# Altium schematic sheet HalfBridge.SchDoc
size A1; SheetNumber: 2; SheetTotal: 5
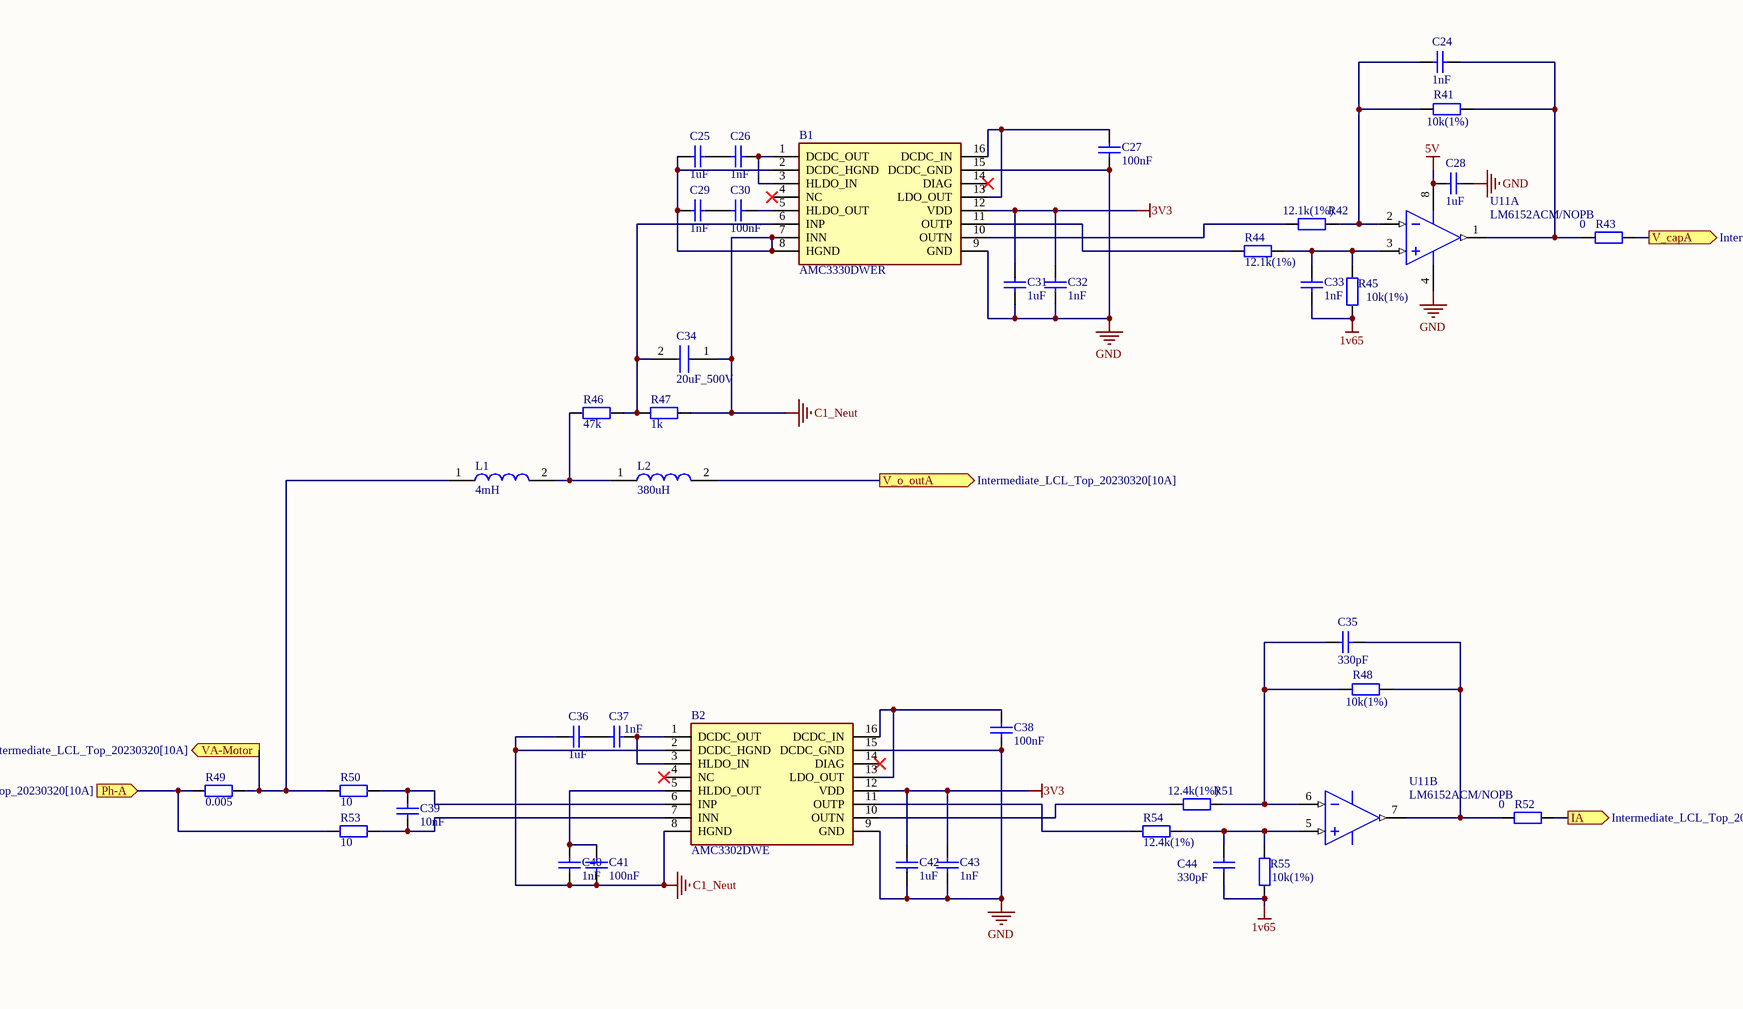
[diagram p0: HalfBridge.SchDoc, top left]
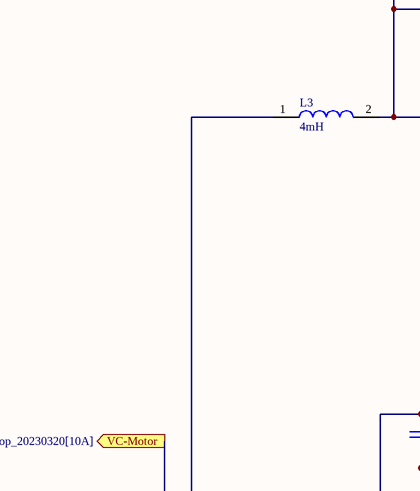
[diagram p1: HalfBridge.SchDoc, top middle]
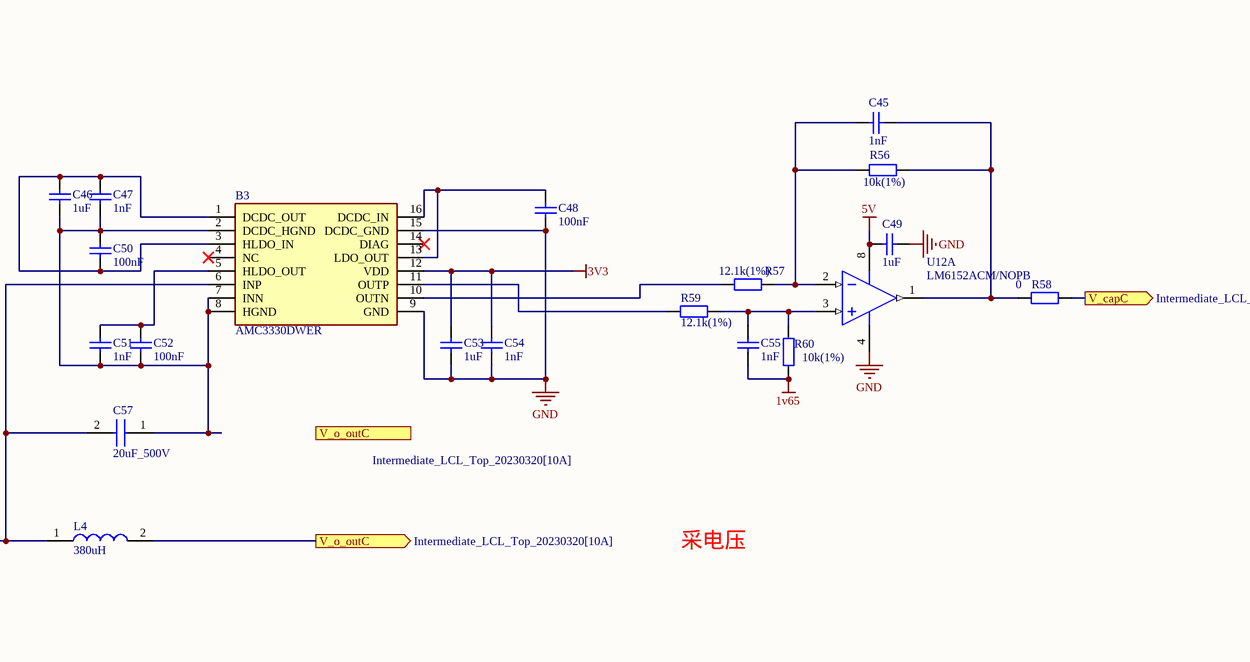
[diagram p2: HalfBridge.SchDoc, top right]
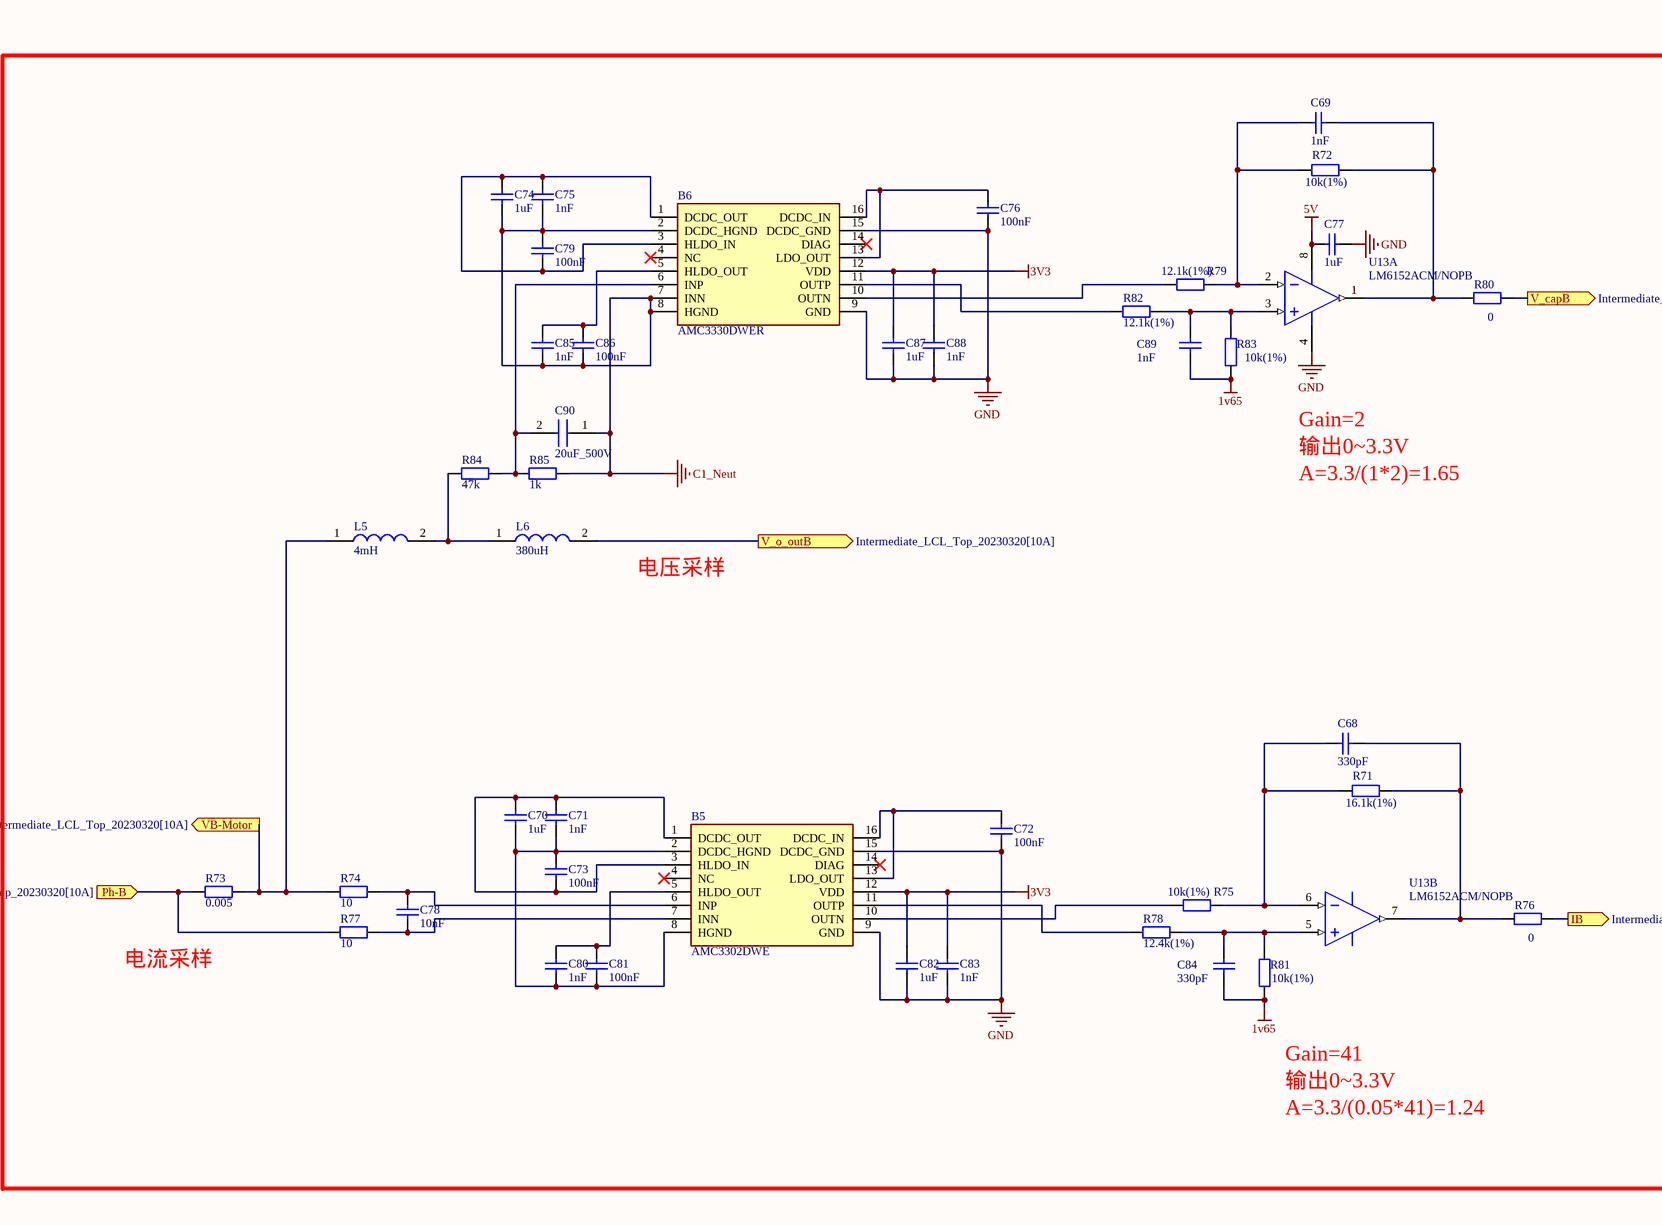
[diagram p3: HalfBridge.SchDoc, bottom left]
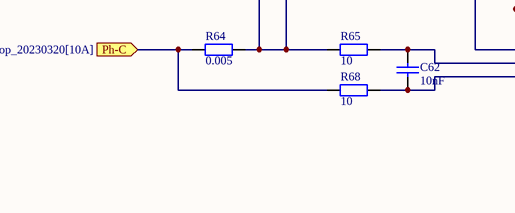
[diagram p4: HalfBridge.SchDoc, bottom middle]
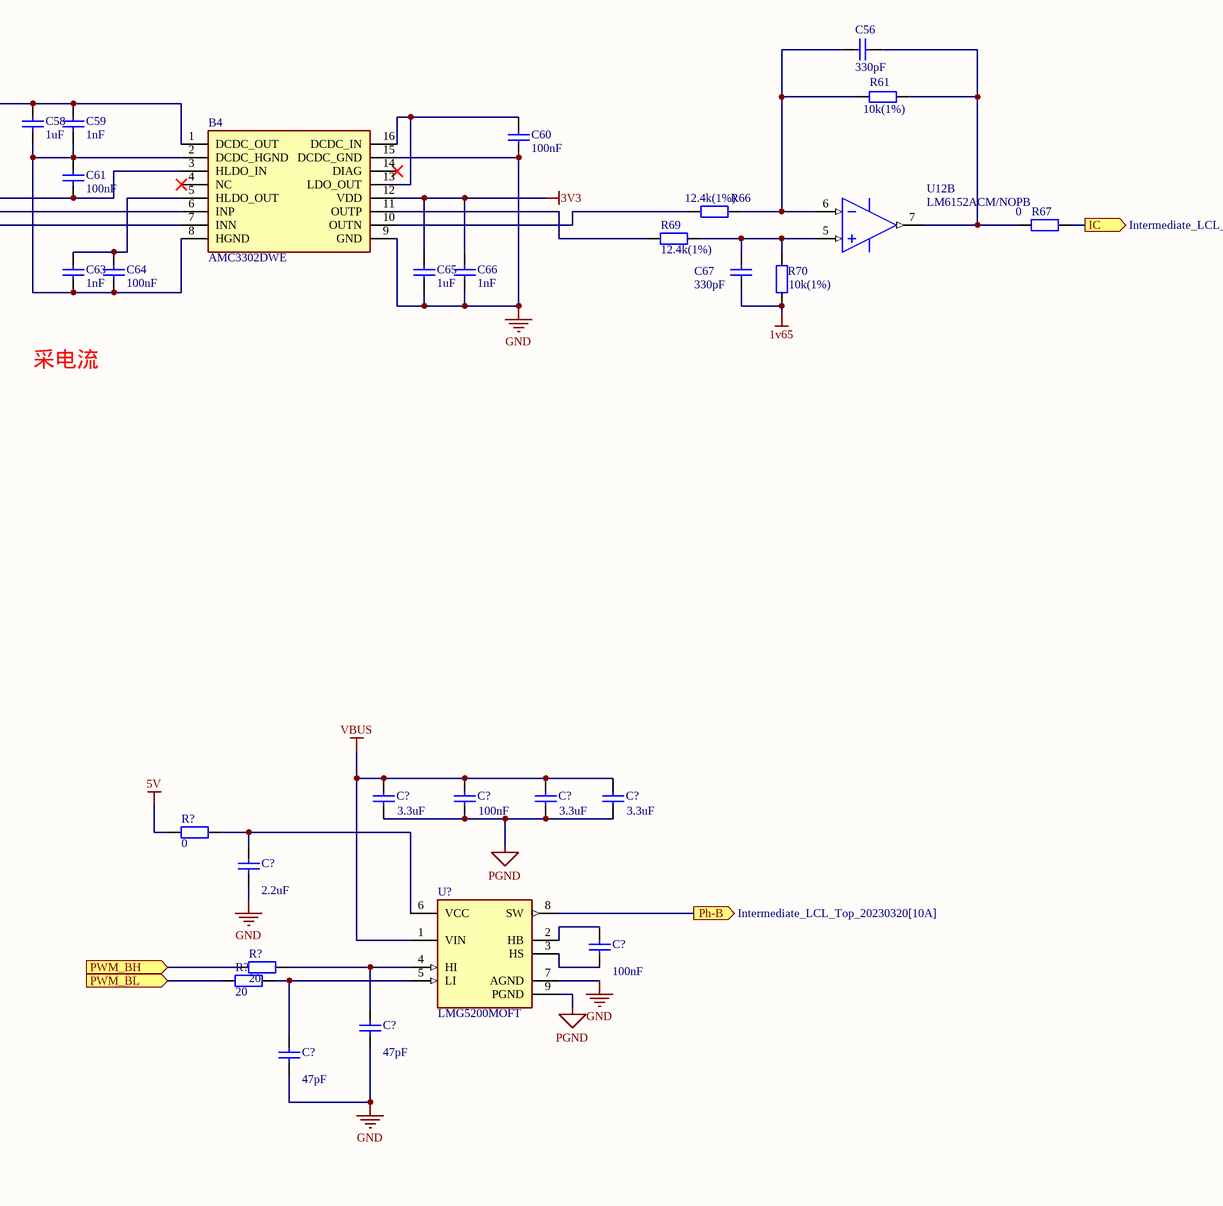
[diagram p5: HalfBridge.SchDoc, bottom right]

## Parts
(Parts that share a designator on the sheet are numbered #1, #2 ... from top to bottom, then left to right.)
B1  AMC3330DWER  [SOIC127P1030X265-16N]
B2  AMC3302DWE  [SOIC127P1030X265-16N]
B3  AMC3330DWER  [SOIC127P1030X265-16N]
B4  AMC3302DWE  [SOIC127P1030X265-16N]
B5  AMC3302DWE  [SOIC127P1030X265-16N]
B6  AMC3330DWER  [SOIC127P1030X265-16N]
C24  1nF  [CAPC1608X06N]
C25  1uF  [CAPC1608X06N]
C26  1nF  [CAPC1608X06N]
C27  100nF  [CAPC1608X06N]
C28  1uF  [CAPC1608X06N]
C29  1nF  [CAPC1608X06N]
C30  100nF  [CAPC1608X06N]
C31  1uF  [CAPC1608X06N]
C32  1nF  [CAPC1608X06N]
C33  1nF  [CAPC1608X06N]
C34  20uF_500V  [Film Capacitor PHE450HF7220JR06L2]
C35  330pF  [CAPC1608X06N]
C36  1uF  [CAPC1608X06N]
C37  1nF  [CAPC1608X06N]
C38  100nF  [CAPC1608X06N]
C39  10nF  [CAPC1608X06N]
C40  1nF  [CAPC1608X06N]
C41  100nF  [CAPC1608X06N]
C42  1uF  [CAPC1608X06N]
C43  1nF  [CAPC1608X06N]
C44  330pF  [CAPC1608X06N]
C45  1nF  [CAPC1608X06N]
C46  1uF  [CAPC1608X06N]
C47  1nF  [CAPC1608X06N]
C48  100nF  [CAPC1608X06N]
C49  1uF  [CAPC1608X06N]
C50  100nF  [CAPC1608X06N]
C51  1nF  [CAPC1608X06N]
C52  100nF  [CAPC1608X06N]
C53  1uF  [CAPC1608X06N]
C54  1nF  [CAPC1608X06N]
C55  1nF  [CAPC1608X06N]
C56  330pF  [CAPC1608X06N]
C57  20uF_500V  [Film Capacitor PHE450HF7220JR06L2]
C58  1uF  [CAPC1608X06N]
C59  1nF  [CAPC1608X06N]
C60  100nF  [CAPC1608X06N]
C61  100nF  [CAPC1608X06N]
C62  10nF  [CAPC1608X06N]
C63  1nF  [CAPC1608X06N]
C64  100nF  [CAPC1608X06N]
C65  1uF  [CAPC1608X06N]
C66  1nF  [CAPC1608X06N]
C67  330pF  [CAPC1608X06N]
C68  330pF  [CAPC1608X06N]
C69  1nF  [CAPC1608X06N]
C70  1uF  [CAPC1608X06N]
C71  1nF  [CAPC1608X06N]
C72  100nF  [CAPC1608X06N]
C73  100nF  [CAPC1608X06N]
C74  1uF  [CAPC1608X06N]
C75  1nF  [CAPC1608X06N]
C76  100nF  [CAPC1608X06N]
C77  1uF  [CAPC1608X06N]
C78  10nF  [CAPC1608X06N]
C79  100nF  [CAPC1608X06N]
C80  1nF  [CAPC1608X06N]
C81  100nF  [CAPC1608X06N]
C82  1uF  [CAPC1608X06N]
C83  1nF  [CAPC1608X06N]
C84  330pF  [CAPC1608X06N]
C85  1nF  [CAPC1608X06N]
C86  100nF  [CAPC1608X06N]
C87  1uF  [CAPC1608X06N]
C88  1nF  [CAPC1608X06N]
C89  1nF  [CAPC1608X06N]
C90  20uF_500V  [Film Capacitor PHE450HF7220JR06L2]
C?#1  100nF  [CAPC1608X06N]
C?#2  3.3uF  [CAPC1608X06N]
C?#3  3.3uF  [CAPC1608X06N]
C?#4  3.3uF  [CAPC1608X06N]
C?#5  2.2uF  [CAPC1608X06N]
C?#6  100nF  [CAPC1608X06N]
C?#7  47pF  [CAPC1608X06N]
C?#8  47pF  [CAPC1608X06N]
L1  4mH  [4mH Custom]
L2  380uH  [380uH Custom]
L3  4mH  [4mH Custom]
L4  380uH  [380uH Custom]
L5  4mH  [4mH Custom]
L6  380uH  [380uH Custom]
R41  10k(1%)  [RESC1608X05N]
R42  12.1k(1%)  [RESC1608X05N]
R43  0  [RESC1608X05N]
R44  12.1k(1%)  [RESC1608X05N]
R45  10k(1%)  [RESC1608X05N]
R46  47k  [RESC1608X05N]
R47  1k  [RESC1608X05N]
R48  10k(1%)  [RESC1608X05N]
R49  0.005  [RESC1608X05N]
R50  10  [RESC1608X05N]
R51  12.4k(1%)  [RESC1608X05N]
R52  0  [RESC1608X05N]
R53  10  [RESC1608X05N]
R54  12.4k(1%)  [RESC1608X05N]
R55  10k(1%)  [RESC1608X05N]
R56  10k(1%)  [RESC1608X05N]
R57  12.1k(1%)  [RESC1608X05N]
R58  0  [RESC1608X05N]
R59  12.1k(1%)  [RESC1608X05N]
R60  10k(1%)  [RESC1608X05N]
R61  10k(1%)  [RESC1608X05N]
R64  0.005  [RESC1608X05N]
R65  10  [RESC1608X05N]
R66  12.4k(1%)  [RESC1608X05N]
R67  0  [RESC1608X05N]
R68  10  [RESC1608X05N]
R69  12.4k(1%)  [RESC1608X05N]
R70  10k(1%)  [RESC1608X05N]
R71  16.1k(1%)  [RESC1608X05N]
R72  10k(1%)  [RESC1608X05N]
R73  0.005  [RESC1608X05N]
R74  10  [RESC1608X05N]
R75  10k(1%)  [RESC1608X05N]
R76  0  [RESC1608X05N]
R77  10  [RESC1608X05N]
R78  12.4k(1%)  [RESC1608X05N]
R79  12.1k(1%)  [RESC1608X05N]
R80  0  [RESC1608X05N]
R81  10k(1%)  [RESC1608X05N]
R82  12.1k(1%)  [RESC1608X05N]
R83  10k(1%)  [RESC1608X05N]
R84  47k  [RESC1608X05N]
R85  1k  [RESC1608X05N]
R?#1  0  [RESC1608X05N]
R?#2  20  [RESC1608X05N]
R?#3  20  [RESC1608X05N]
U11  LM6152ACM/NOPB  [D0008A_L]  (parts A,B of 2)
U12  LM6152ACM/NOPB  [D0008A_L]  (parts A,B of 2)
U13  LM6152ACM/NOPB  [D0008A_L]  (parts A,B of 2)
U?  LMG5200MOFT  [FP-MOF0009A-MFG]

## Ports
IA (out, see Intermediate_LCL_Top_20230320[10A], Phase Current Voltage Sense[1B]), IB (out, see Intermediate_LCL_Top_20230320[10A], Phase Current Voltage Sense[1C]), IC (out, see Intermediate_LCL_Top_20230320[10A], Phase Current Voltage Sense[1D]), Ph-A (in, see Intermediate_LCL_Top_20230320[10A]), Ph-B (in, see Intermediate_LCL_Top_20230320[10A]), Ph-B (out, see Intermediate_LCL_Top_20230320[10A]), Ph-C (in, see Intermediate_LCL_Top_20230320[10A]), PWM_BH (in), PWM_BL (in), V_capA (out, see Intermediate_LCL_Top_20230320[10A]), V_capB (out, see Intermediate_LCL_Top_20230320[10A]), V_capC (out, see Intermediate_LCL_Top_20230320[10A]), V_o_outA (out, see Intermediate_LCL_Top_20230320[10A]), V_o_outB (out, see Intermediate_LCL_Top_20230320[10A]), V_o_outC (out, see Intermediate_LCL_Top_20230320[10A]), VA-Motor (out, see Intermediate_LCL_Top_20230320[10A]), VB-Motor (out, see Intermediate_LCL_Top_20230320[10A]), VC-Motor (out, see Intermediate_LCL_Top_20230320[10A])

## Nets
1v65: C33.1 C44.1 C55.1 C67.1 C84.1 C89.1 R45.1 R55.1 R60.1 R70.1 R81.1 R83.1
3V3: B1.12(VDD) B2.12(VDD) B3.12(VDD) B4.12(VDD) B5.12(VDD) B6.12(VDD) C31.1 C32.1 C42.1 C43.1 C53.1 C54.1 C65.1 C66.1 C82.1 C83.1 C87.1 C88.1
5V: C28.2 C49.2 C77.2 R?#1.2 U11.8(V+) U12.8(V+) U13.8(V+)
C1_Neut: B1.2(DCDC_HGND) B1.7(INN) B1.8(HGND) B2.2(DCDC_HGND) B2.8(HGND) B6.2(DCDC_HGND) B6.7(INN) B6.8(HGND) C25.1 C29.1 C34.1 C36.1 C40.2 C41.2 C74.2 C75.2 C79.1 C85.2 C86.2 C90.1 R47.1 R85.1
GND: B1.9(GND) B1.15(DCDC_GND) B2.9(GND) B2.15(DCDC_GND) B3.9(GND) B3.15(DCDC_GND) B4.9(GND) B4.15(DCDC_GND) B5.9(GND) B5.15(DCDC_GND) B6.9(GND) B6.15(DCDC_GND) C27.2 C28.1 C31.2 C32.2 C38.2 C42.2 C43.2 C48.2 C49.1 C53.2 C54.2 C60.2 C65.2 C66.2 C72.2 C76.2 C77.1 C82.2 C83.2 C87.2 C88.2 C?#5.1 C?#7.2 C?#8.2 U11.4(V-) U12.4(V-) U13.4(V-) U?.7(AGND)
PGND: C?#1.2 C?#2.1 C?#3.1 C?#4.1 U?.9(PGND)
VBUS: C?#1.1 C?#2.2 C?#3.2 C?#4.2 U?.1(VIN)
IA: R52.1 ; port IA
IB: R76.1 ; port IB
IC: R67.1 ; port IC
Ph-A: R49.1 R53.1 ; port Ph-A
Ph-B: R73.1 R77.1 U?.8(SW) ; port Ph-B
Ph-C: R64.1 R68.1 ; port Ph-C
PWM_BH: R?#2.2 ; port PWM_BH
PWM_BL: R?#3.2 ; port PWM_BL
V_capA: R43.1 ; port V_capA
V_capB: R80.1 ; port V_capB
V_capC: R58.1 ; port V_capC
V_o_outA: L2.2 ; port V_o_outA
V_o_outB: L6.2 ; port V_o_outB
V_o_outC: L4.2 ; port V_o_outC
VA-Motor: L1.1 R49.2 R50.1 ; port VA-Motor
VB-Motor: L5.1 R73.2 R74.1 ; port VB-Motor
VC-Motor: L3.1 R64.2 R65.1 ; port VC-Motor
NetB1_1: B1.1(DCDC_OUT) B1.3(HLDO_IN) C26.2
NetB1_5: B1.5(HLDO_OUT) C30.2
NetB1_6: B1.6(INP) C34.2 R46.1 R47.2
NetB1_10: B1.10(OUTN) R42.2
NetB1_11: B1.11(OUTP) R44.1
NetB1_13: B1.13(LDO_OUT) B1.16(DCDC_IN) C27.1
NetB2_1: B2.1(DCDC_OUT) B2.3(HLDO_IN) C37.2
NetB2_5: B2.5(HLDO_OUT) C40.1 C41.1
NetB2_6: B2.6(INP) C39.1 R50.2
NetB2_7: B2.7(INN) C39.2 R53.2
NetB2_10: B2.10(OUTN) R51.2
NetB2_11: B2.11(OUTP) R54.1
NetB2_13: B2.13(LDO_OUT) B2.16(DCDC_IN) C38.1
NetB3_1: B3.1(DCDC_OUT) B3.3(HLDO_IN) C46.1 C47.1 C50.2
NetB3_2: B3.2(DCDC_HGND) B3.7(INN) B3.8(HGND) C46.2 C47.2 C50.1 C51.2 C52.2 C57.1
NetB3_5: B3.5(HLDO_OUT) C51.1 C52.1
NetB3_6: B3.6(INP) C57.2 L3.2 L4.1
NetB3_10: B3.10(OUTN) R57.2
NetB3_11: B3.11(OUTP) R59.1
NetB3_13: B3.13(LDO_OUT) B3.16(DCDC_IN) C48.1
NetB4_1: B4.1(DCDC_OUT) B4.3(HLDO_IN) C58.1 C59.1 C61.2
NetB4_2: B4.2(DCDC_HGND) B4.8(HGND) C58.2 C59.2 C61.1 C63.2 C64.2
NetB4_5: B4.5(HLDO_OUT) C63.1 C64.1
NetB4_6: B4.6(INP) C62.1 R65.2
NetB4_7: B4.7(INN) C62.2 R68.2
NetB4_10: B4.10(OUTN) R66.2
NetB4_11: B4.11(OUTP) R69.1
NetB4_13: B4.13(LDO_OUT) B4.16(DCDC_IN) C60.1
NetB5_1: B5.1(DCDC_OUT) B5.3(HLDO_IN) C70.1 C71.1 C73.2
NetB5_2: B5.2(DCDC_HGND) B5.8(HGND) C70.2 C71.2 C73.1 C80.2 C81.2
NetB5_5: B5.5(HLDO_OUT) C80.1 C81.1
NetB5_6: B5.6(INP) C78.1 R74.2
NetB5_7: B5.7(INN) C78.2 R77.2
NetB5_10: B5.10(OUTN) R75.2
NetB5_11: B5.11(OUTP) R78.1
NetB5_13: B5.13(LDO_OUT) B5.16(DCDC_IN) C72.1
NetB6_1: B6.1(DCDC_OUT) B6.3(HLDO_IN) C74.1 C75.1 C79.2
NetB6_5: B6.5(HLDO_OUT) C85.1 C86.1
NetB6_6: B6.6(INP) C90.2 R84.1 R85.2
NetB6_10: B6.10(OUTN) R79.2
NetB6_11: B6.11(OUTP) R82.1
NetB6_13: B6.13(LDO_OUT) B6.16(DCDC_IN) C76.1
NetC24_1: C24.1 R41.1 R43.2 U11.1(OUTA)
NetC24_2: C24.2 R41.2 R42.1 U11.2(INA-)
NetC25_2: C25.2 C26.1
NetC29_2: C29.2 C30.1
NetC33_2: C33.2 R44.2 R45.2 U11.3(INA+)
NetC35_1: C35.1 R48.1 R52.2 U11.7(OUTB)
NetC35_2: C35.2 R48.2 R51.1 U11.6(INB-)
NetC36_2: C36.2 C37.1
NetC44_2: C44.2 R54.2 R55.2 U11.5(INB+)
NetC45_1: C45.1 R56.1 R58.2 U12.1(OUTA)
NetC45_2: C45.2 R56.2 R57.1 U12.2(INA-)
NetC55_2: C55.2 R59.2 R60.2 U12.3(INA+)
NetC56_1: C56.1 R61.1 R67.2 U12.7(OUTB)
NetC56_2: C56.2 R61.2 R66.1 U12.6(INB-)
NetC67_2: C67.2 R69.2 R70.2 U12.5(INB+)
NetC68_1: C68.1 R71.1 R76.2 U13.7(OUTB)
NetC68_2: C68.2 R71.2 R75.1 U13.6(INB-)
NetC69_1: C69.1 R72.1 R80.2 U13.1(OUTA)
NetC69_2: C69.2 R72.2 R79.1 U13.2(INA-)
NetC84_2: C84.2 R78.2 R81.2 U13.5(INB+)
NetC89_2: C89.2 R82.2 R83.2 U13.3(INA+)
NetC?#5_2: C?#5.2 R?#1.1 U?.6(VCC)
NetC?#6_1: C?#6.1 U?.2(HB)
NetC?#6_2: C?#6.2 U?.3(HS)
NetC?#7_1: C?#7.1 R?#2.1 U?.4(HI)
NetC?#8_1: C?#8.1 R?#3.1 U?.5(LI)
NetL1_2: L1.2 L2.1 R46.2
NetL5_2: L5.2 L6.1 R84.2

Not connected (* = marked no-connect by the designer): B1 4(NC)* 14(DIAG)*; B2 4(NC)* 14(DIAG)*; B3 4(NC)* 14(DIAG)*; B4 4(NC)* 14(DIAG)*; B5 4(NC)* 14(DIAG)*; B6 4(NC)* 14(DIAG)*

## Notes on the sheet
- 采电压
- 采电流
- Gain=2
- 输出0~3.3V
- A=3.3/(1*2)=1.65
- 电压采样
- 电流采样
- Gain=41
- A=3.3/(0.05*41)=1.24

## Library data of the parts
B1 B3 B6 = AMC3330DWER: Isolation Amplifiers +/-1-V input, precision reinforced isolated amplifier with integrated DC/DC converter and high CMTI 16-SOIC -40 to 125; Manufacturer_Name: Texas Instruments; Geometry.Height: 2.65mm; Manufacturer_Part_Number: AMC3330DWER; Mouser Part Number: 595-AMC3330DWER; Mouser Price/Stock: https://www.mouser.co.uk/ProductDetail/Texas-Instruments/AMC3330DWER?qs=zW32dvEIR3u5qLqnY17MoA%3D%3D; Arrow Part Number: AMC3330DWER; Arrow Price/Stock: https://www.arrow.com/en/products/amc3330dwer/texas-instruments?region=nac; Datasheet Link: https://www.ti.com/lit/ds/symlink/amc3330.pdf?ts=1627904955935&ref_url=https%253A%252F%252Fwww.ti.com%252Fproduct%252FAMC3330
B2 B4 B5 = AMC3302DWE: Isolation Amplifiers +/-50-mV input, precision reinforced isolated amplifier with integrated DC/DC converter 16-SOIC -40 to 125; Manufacturer_Name: Texas Instruments; Geometry.Height: 2.65mm; Manufacturer_Part_Number: AMC3302DWE; Mouser Part Number: 595-AMC3302DWE; Mouser Price/Stock: https://www.mouser.co.uk/ProductDetail/Texas-Instruments/AMC3302DWE?qs=DRkmTr78QAT3OfY8Rd%252BeWA%3D%3D; Arrow Part Number: AMC3302DWE; Arrow Price/Stock: https://www.arrow.com/en/products/amc3302dwe/texas-instruments?region=nac; Datasheet Link: https://www.ti.com/lit/ds/symlink/amc3302.pdf?ts=1643366130509
C24-C33 C35-C56 C58-C89 C?#1-C?#8 = Cap: Capacitor; Published: 8-Jun-2000; LatestRevisionDate: 17-Jul-2002; LatestRevisionNote: Re-released for DXP Platform.; PackageReference: RAD-0.3; Publisher: Altium Limited; PackageDescription: Radial Cap, Thru-Hole; 2 Leads; 0.3 in Pin Spacing
  C24 C26 C29 C32 C33 C37 C40 C43 C45 C47 C51 C54 C55 C59 C63 C66 C69 C71 C75 C80 C83 C85 C88 C89: Value: 1nF
  C25 C28 C31 C36 C42 C46 C49 C53 C58 C65 C70 C74 C77 C82 C87: Value: 1uF
  C27 C30 C38 C41 C48 C50 C52 C60 C61 C64 C72 C73 C76 C79 C81 C86 C?#1 C?#6: Value: 100nF
  C35 C44 C56 C67 C68 C84: Value: 330pF
  C39 C62 C78: Value: 10nF
  C?#2-C?#4: Value: 3.3uF
  C?#5: Value: 2.2uF
  C?#7 C?#8: Value: 47pF
C34 C57 C90 = PHE450HF7220JR06L2: KEMET PHE450 Metallised Polypropylene Film Capacitor, 180 V ac, 250 V dc, ±5%, 2.2μF, Through Hole; Datasheet Link: https://docs.rs-online.com/a458/0900766b817170df.pdf; Height: 24.5mm; Manufacturer_Name: KEMET; Manufacturer_Part_Number: PHE450HF7220JR06L2
L1 L3 L5 = 4mH Custom Inductor
L2 L4 L6 = 380uH Custom Inductor
R41-R45 R48 R51 R52 R54-R61 R66 R67 R69-R72 R75 R76 R78-R83 = Res2: Resistor; Published: 8-Jun-2000; LatestRevisionDate: 17-Jul-2002; LatestRevisionNote: Re-released for DXP Platform.; PackageReference: AXIAL-0.4; Publisher: Altium Limited; PackageDescription: Axial Device, Thru-Hole; 2 Leads; 0.4 in Pin Spacing
  R41 R45 R48 R55 R56 R60 R61 R70 R72 R75 R81 R83: Value: 10k(1%)
  R42 R44 R57 R59 R79 R82: Value: 12.1k(1%)
  R43 R52 R58 R67 R76 R80: Value: 0
  R51 R54 R66 R69 R78: Value: 12.4k(1%)
  R71: Value: 16.1k(1%)
R46 R47 R49 R50 R53 R64 R65 R68 R73 R74 R77 R84 R85 R?#1-R?#3 = 0603 100KΩ (1003) 1%_4: 贴片电阻; Value: 1MΩ(1%); ComponentLink1Description: 供应商链接; ComponentLink1URL: http://www.szlcsc.com/product/details_26546.html; Package: 0603; Supplier: LC; SuppliersPartNumber: C25803
U11-U13 = LM6152ACM/NOPB: Dual and Quad 75 MHz GBW Rail-to-Rail I/O Operational Amplifiers, 8-pin Narrow SOIC, Pb-Free; Manufacturer: Texas Instruments; PackageTopMarking: NSZXTT*LM61*52ACM; PowerWise: Y; Package Reference: D0008A; Code_JEDEC: MS-012-AA; Code_IPC: SOIC127P600-8; PinCount: 8; ComponentLink1URL: http://www.ti.com/general/docs/lit/getliterature.tsp?genericPartNumber=LM6152&fileType=pdf; PackageDescription: SOIC Narrow, 4.9 x 3.9 x 1.45mm, 8 Lead, 1.27mm Pitch; CompType: Amplifiers; RoHS: Y; ComponentLink1Description: Datasheet URL
U? = CMP-04912-000022-2: None; Output Current per Channel: 10A; Interface: Logic; Min Operating Temperature: -40°C; Mount: Surface Mount; Case/Package: QFN; RoHS Compliant: Yes; Packaging: Cut Tape; Max Operating Temperature: 125°C; Number of Pins: 9